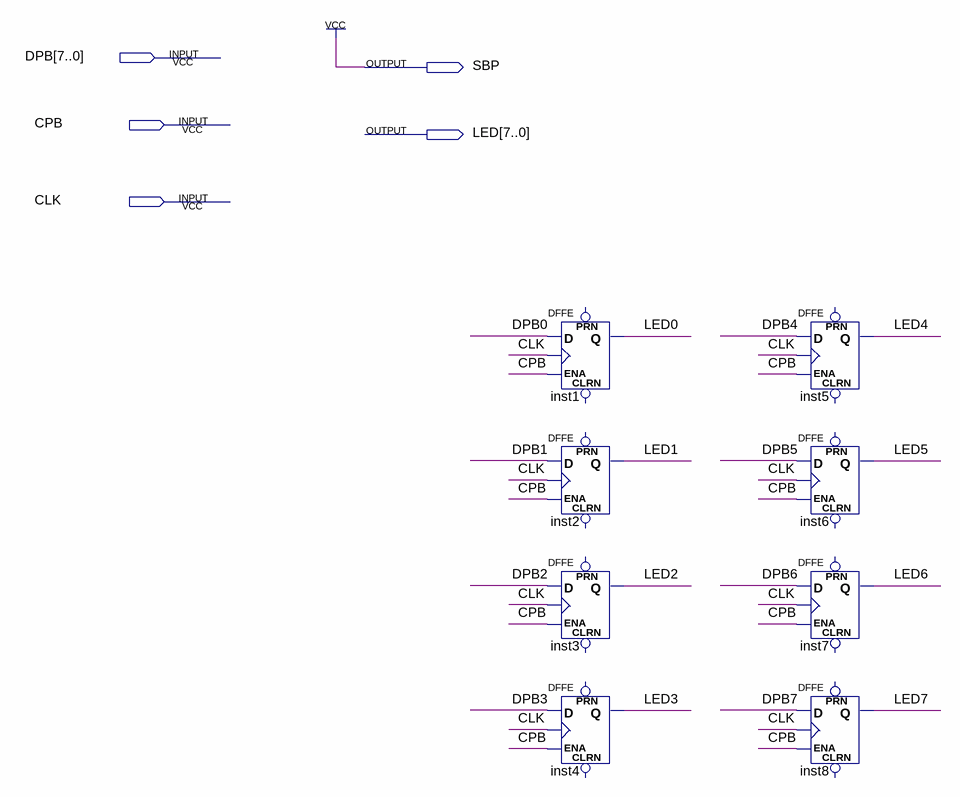
[diagram p0: schematic sheet]
// Quartus schematic UB.bdf as structural Verilog: 8 symbols, 5 pins
module UB (
  input  [7:0] DPB,
  input  CPB,
  input  CLK,
  output SBP,
  output [7:0] LED
);

  DFFE inst1 (.D(DPB[0]), .CLK(CLK), .ENA(CPB), .Q(LED[0]));  // open: PRN, CLRN
  DFFE inst2 (.D(DPB[1]), .CLK(CLK), .ENA(CPB), .Q(LED[1]));  // open: PRN, CLRN
  DFFE inst3 (.D(DPB[2]), .CLK(CLK), .ENA(CPB), .Q(LED[2]));  // open: PRN, CLRN
  DFFE inst4 (.D(DPB[3]), .CLK(CLK), .ENA(CPB), .Q(LED[3]));  // open: PRN, CLRN
  DFFE inst5 (.D(DPB[4]), .CLK(CLK), .ENA(CPB), .Q(LED[4]));  // open: PRN, CLRN
  DFFE inst6 (.D(DPB[5]), .CLK(CLK), .ENA(CPB), .Q(LED[5]));  // open: PRN, CLRN
  DFFE inst7 (.D(DPB[6]), .CLK(CLK), .ENA(CPB), .Q(LED[6]));  // open: PRN, CLRN
  DFFE inst8 (.D(DPB[7]), .CLK(CLK), .ENA(CPB), .Q(LED[7]));  // open: PRN, CLRN

  assign SBP = 1'b1;
endmodule
